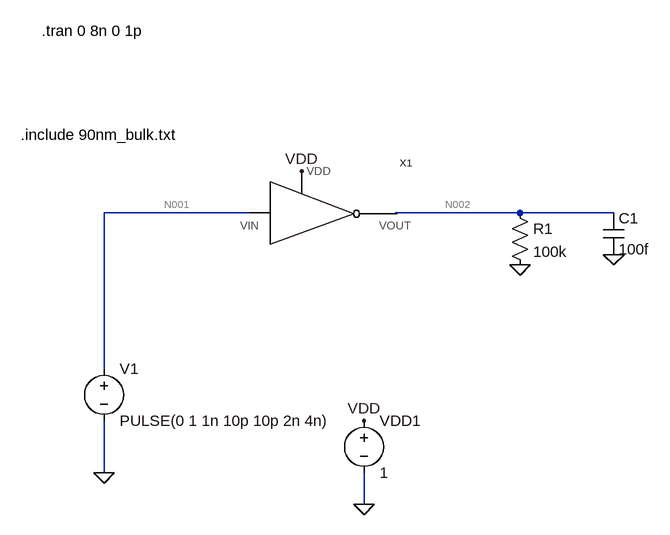
[diagram p0: schematic Draft.asc]
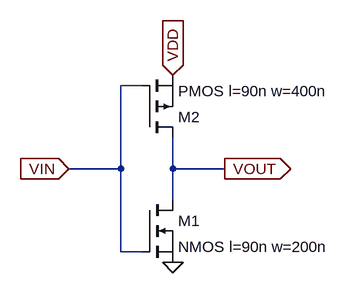
[diagram p1: sub-circuit inverter.asc]
Draft.asc, the LTspice schematic file:
Version 4
SHEET 1 880 708
WIRE -272 240 -496 240
WIRE 144 240 -48 240
WIRE 288 240 144 240
WIRE -496 480 -496 240
WIRE -496 640 -496 560
WIRE -96 688 -96 640
FLAG 144 320 0
FLAG 288 304 0
FLAG -496 640 0
FLAG -96 560 VDD
FLAG -96 688 0
FLAG -192 176 VDD
SYMBOL voltage -496 464 R0
WINDOW 123 0 0 Left 0
WINDOW 39 0 0 Left 0
SYMATTR InstName V1
SYMATTR Value PULSE(0 1 1n 10p 10p 2n 4n)
SYMBOL res 128 224 R0
SYMATTR InstName R1
SYMATTR Value 100k
SYMBOL cap 272 240 R0
SYMATTR InstName C1
SYMATTR Value 100f
SYMBOL voltage -96 544 R0
WINDOW 123 0 0 Left 0
WINDOW 39 0 0 Left 0
SYMATTR InstName VDD1
SYMATTR Value 1
SYMBOL inverter -192 240 R0
WINDOW 39 0 0 Left 0
SYMATTR InstName X1
TEXT -624 120 Left 2 !.include 90nm_bulk.txt
TEXT -592 -40 Left 2 !.tran 0 8n 0 1p

inverter.asc, the sub-circuit schematic file:
Version 4
SHEET 1 880 680
WIRE 192 16 160 16
WIRE 160 144 160 16
WIRE 160 144 80 144
WIRE 240 144 240 96
WIRE 320 144 240 144
WIRE 240 192 240 144
WIRE 160 272 160 144
WIRE 192 272 160 272
FLAG 240 288 0
FLAG 80 144 VIN
IOPIN 80 144 In
FLAG 240 0 VDD
IOPIN 240 0 In
FLAG 320 144 VOUT
IOPIN 320 144 Out
SYMBOL nmos 192 192 R0
SYMATTR InstName M1
SYMATTR Value NMOS l=90n w=200n
SYMBOL pmos 192 96 M180
SYMATTR InstName M2
SYMATTR Value PMOS l=90n w=400n

The netlist it stands for:
* Draft.asc
V1 N001 0 PULSE(0 1 1n 10p 10p 2n 4n)
R1 N002 0 100k
C1 N002 0 100f
VDD1 VDD 0 1
XX1 N001 VDD N002 inverter

* block symbol definitions
.subckt inverter VIN VDD VOUT
M1 VOUT VIN 0 0 NMOS l=90n w=200n
M2 VOUT VIN VDD VDD PMOS l=90n w=400n
.ends inverter

.model NMOS NMOS
.model PMOS PMOS
.lib standard.mos
.include 90nm_bulk.txt
.tran 0 8n 0 1p
.backanno
.end

* Results of the author's LTspice run, read from the files saved beside the schematic
* Operating Point, zero values left out:
*   V(n002) = 972.5 mV
*   V(vdd) = 1 V
*   I(R1) = 9.725 µA
*   I(V1) = 110.4 pA
*   I(Vdd1) = -9.73 µA
*   Ix(x1:VIN) = -110.4 pA
*   Ix(x1:VDD) = 9.73 µA
*   Ix(x1:VOUT) = -9.725 µA
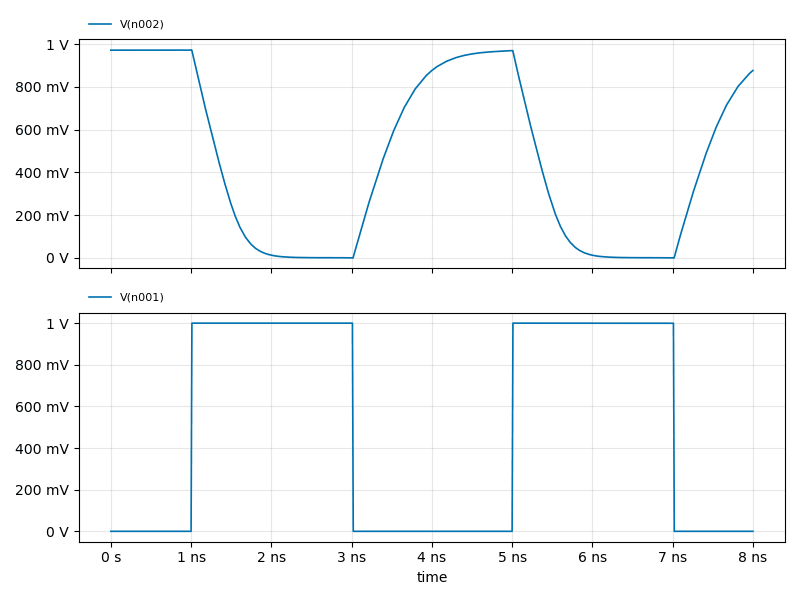
[diagram p2: Transient Analysis of Draft.asc, plotted from the saved traces]
* Transient Analysis, 1 run:
*   V(n002): min -1.184 mV, max 974 mV, average 455.6 mV, rms 607.7 mV, last 877.4 mV
*   V(n001): min 0 V, max 1 V, average 502.5 mV, rms 708.3 mV, last 0 V